# Altium schematic sheet 06-1G Phy0.SchDoc
size B; SheetNumber: 6; SheetTotal: 25; SPICEModelCacheVZIIJVTD: <root> / <DocumentId>VZIIJVTD</DocumentId> / <CacheFrame Number="0"> / <Model Name="emk105bj105_v-f" Kind="CKT"> / <Text>* EMK105BJ105_V-F     SPICE MODEL  ( General Type ) / *-------------------------------------------------------------------------------------------------------- / * Model Generated by TAIYO YUDEN Corporation (http://www.ty-top.com) / * Version 1.0 / * TAIYO YUDEN Control No. 170508_130520 / * Copyright(c) 2012 TAIYO YUDEN CO.,LTD. All Rights Reserved. / *-------------------------------------------------------------------------------------------------------- / * / * Products Name : Multilayer Ceramic Capacitors / * / * Characteristics : / *     Capacitance : 1 uF , Rated Voltage : 16V , TCC : X5R / *     Case Size : 1.0 x 0.5 / 0.039 x 0.02 [mm/inch] , Thickness : 0.5 / 0.02 [mm/inch] / *     (Conditions: Temperature = 25 degC , DC Bias Current/Voltage = 0A / 0V) / * / * Frequency Range : 40Hz - 3GHz / * / * External Node Assignments : / * / *  1  o---| |---o  2 / * / *-------------------------------------------------------------------------------------------------------- / .SubCkt EMK105BJ105_V-F 1 2 / **************************** / C0 1 110 0.68309u / Cm 1 101 0.26053u / C1 101 102 0.94076u / Rc1 101 102 1.9029k / C2 102 103 0.66707u / Rc2 102 103 120.36 / C3 103 110 0.57203u / Rc3 103 110 2.1097 / C2m 1 301 0.1871u / C21 301 302 3.2494u / Rc21 301 302 1.1117k / C22 302 303 2.1014u / Rc22 302 303 1.484k / C23 303 304 2.1172u / Rc23 303 304 1.3876k / C24 304 305 0.75729u / Rc24 304 305 332.59 / C25 305 306 0.94401u / Rc25 305 306 249.09 / C26 306 307 0.34674u / Rc26 306 307 28.352 / C27 307 308 0.37158u / Rc27 307 308 19.989 / C28 308 309 0.17933u / Rc28 308 309 31.748 / C29 309 110 0.016445u / Rc29 309 110 1.0592 / Rp0 1 110 100Meg / L0 110 120 0.2216n / Lm 120 130 0.1509n / L1 120 121 0.12659n / RL1 121 130 0.85161 / L2 120 122 0.15996n / RL2 122 130 0.42469 / L3 120 123 7.9543n / RL3 123 130 0.54643m / CR 120 124 0.24334u / LR 124 125 0.090738n / RR 125 130 68.076m / CL 130 140 2.7354p / LL 130 140 0.10762n / RL 130 140 50.614 / Rs 140 2 7.5416m / **************************** / .ends EMK105BJ105_V-F</Text> / </Model> / </CacheFrame> / </root>
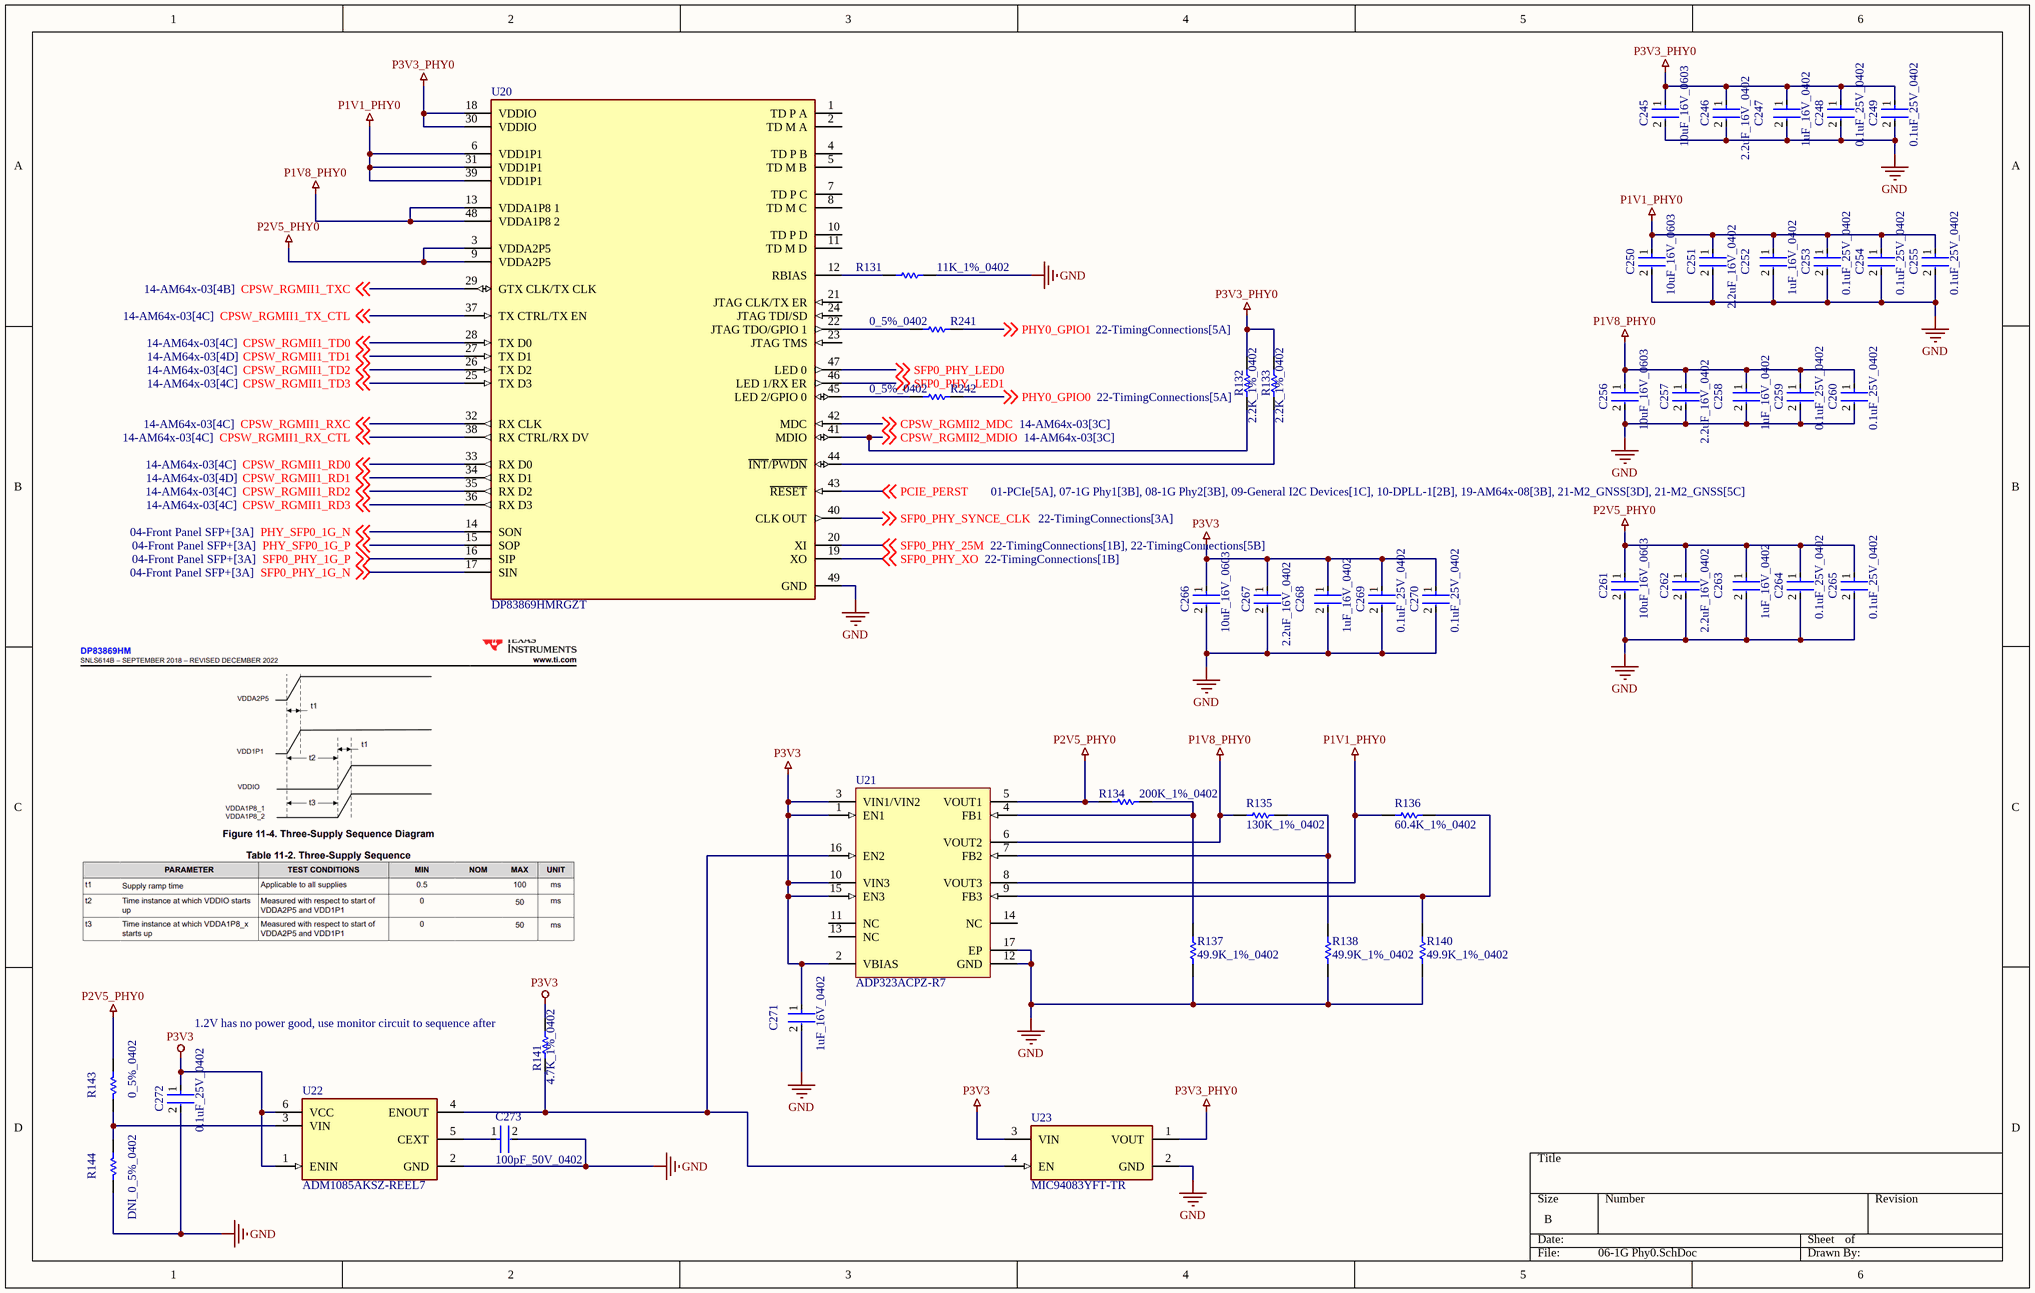
[diagram p0: 06-1G Phy0.SchDoc]

## Parts
C245  10uF_16V_0603  [FP-0603-L_1_6_0_2-W_0_8_0-MFG]
C246  2.2uF_16V_0402  [FP-C1005-050-0_05-IPC_A]
C247  1uF_16V_0402  [FP-0402-L_1_0_0_05-W_0_5-IPC_A]
C248  0.1uF_25V_0402  [FP-0402-L_1_0_1-W_0_5_0_1-IPC_C]
C249  0.1uF_25V_0402  [FP-0402-L_1_0_1-W_0_5_0_1-IPC_C]
C250  10uF_16V_0603  [FP-0603-L_1_6_0_2-W_0_8_0-MFG]
C251  2.2uF_16V_0402  [FP-C1005-050-0_05-IPC_A]
C252  1uF_16V_0402  [FP-0402-L_1_0_0_05-W_0_5-IPC_A]
C253  0.1uF_25V_0402  [FP-0402-L_1_0_1-W_0_5_0_1-IPC_C]
C254  0.1uF_25V_0402  [FP-0402-L_1_0_1-W_0_5_0_1-IPC_C]
C255  0.1uF_25V_0402  [FP-0402-L_1_0_1-W_0_5_0_1-IPC_C]
C256  10uF_16V_0603  [FP-0603-L_1_6_0_2-W_0_8_0-MFG]
C257  2.2uF_16V_0402  [FP-C1005-050-0_05-IPC_A]
C258  1uF_16V_0402  [FP-0402-L_1_0_0_05-W_0_5-IPC_A]
C259  0.1uF_25V_0402  [FP-0402-L_1_0_1-W_0_5_0_1-IPC_C]
C260  0.1uF_25V_0402  [FP-0402-L_1_0_1-W_0_5_0_1-IPC_C]
C261  10uF_16V_0603  [FP-0603-L_1_6_0_2-W_0_8_0-MFG]
C262  2.2uF_16V_0402  [FP-C1005-050-0_05-IPC_A]
C263  1uF_16V_0402  [FP-0402-L_1_0_0_05-W_0_5-IPC_A]
C264  0.1uF_25V_0402  [FP-0402-L_1_0_1-W_0_5_0_1-IPC_C]
C265  0.1uF_25V_0402  [FP-0402-L_1_0_1-W_0_5_0_1-IPC_C]
C266  10uF_16V_0603  [FP-0603-L_1_6_0_2-W_0_8_0-MFG]
C267  2.2uF_16V_0402  [FP-C1005-050-0_05-IPC_A]
C268  1uF_16V_0402  [FP-0402-L_1_0_0_05-W_0_5-IPC_A]
C269  0.1uF_25V_0402  [FP-0402-L_1_0_1-W_0_5_0_1-IPC_C]
C270  0.1uF_25V_0402  [FP-0402-L_1_0_1-W_0_5_0_1-IPC_C]
C271  1uF_16V_0402  [FP-0402-L_1_0_0_05-W_0_5-IPC_A]
C272  0.1uF_25V_0402  [FP-0402-L_1_0_1-W_0_5_0_1-IPC_C]
C273  100pF_50V_0402  [FP-C0402-BB-MFG]
R131  11K_1%_0402  [RESC1005X40X25LL05T10]
R132  2.2K_1%_0402  [RESC1005X40X25ML10T10]
R133  2.2K_1%_0402  [RESC1005X40X25ML10T10]
R134  200K_1%_0402  [RESC1005X40X25LL10T10]
R135  130K_1%_0402  [RESC1005X40X25NL10T10]
R136  60.4K_1%_0402  [RESC1005X40X25LL05T10]
R137  49.9K_1%_0402  [RESC1005X40X25LL10T10]
R138  49.9K_1%_0402  [RESC1005X40X25LL10T10]
R140  49.9K_1%_0402  [RESC1005X40X25LL10T10]
R141  4.7K_1%_0402  [RESC1005X40X25NL10T10]
R143  0_5%_0402  [RESC1005X40X25LL10T10]
R144  DNI_0_5%_0402  [RESC1005X40X25LL10T10]  (no BOM)
R241  0_5%_0402  [RESC1005X40X25LL10T10]
R242  0_5%_0402  [RESC1005X40X25LL10T10]
U20  DP83869HMRGZT  [FP-RGZ0048B-IPC_A]
U21  ADP323ACPZ-R7  [ADI-CP-16-27_N]
U22  ADM1085AKSZ-REEL7  [FP-KS-6-IPC_B]
U23  MIC94083YFT-TR  [FP-FTDFN085085-4LD-PL-1-MFG]

## Nets
GND: C245.2 C246.2 C247.2 C248.2 C249.2 C250.2 C251.2 C252.2 C253.2 C254.2 C255.2 C256.2 C257.2 C258.2 C259.2 C260.2 C261.2 C262.2 C263.2 C264.2 C265.2 C266.2 C267.2 C268.2 C269.2 C270.2 C271.2 C272.2 C273.2 R131.2 R137.1 R138.1 R140.1 R144.2 U20.49(GND) U21.12(GND) U21.17(EP) U22.2(GND) U23.2(GND)
P1V1_PHY0: C250.1 C251.1 C252.1 C253.1 C254.1 C255.1 R136.1 U20.6(VDD1P1) U20.31(VDD1P1) U20.39(VDD1P1) U21.8(VOUT3)
P1V8_PHY0: C256.1 C257.1 C258.1 C259.1 C260.1 R135.1 U20.13(VDDA1P8_1) U20.48(VDDA1P8_2) U21.6(VOUT2)
P2V5_PHY0: C261.1 C262.1 C263.1 C264.1 C265.1 R134.1 R143.1 U20.3(VDDA2P5) U20.9(VDDA2P5) U21.5(VOUT1)
P3V3: C266.1 C267.1 C268.1 C269.1 C270.1 C271.1 C272.1 R141.1 U21.1(EN1) U21.2(VBIAS) U21.3(VIN1/VIN2) U21.10(VIN3) U21.15(EN3) U22.1(ENIN) U22.6(VCC) U23.3(VIN)
P3V3_PHY0: C245.1 C246.1 C247.1 C248.1 C249.1 R132.2 R133.2 U20.18(VDDIO) U20.30(VDDIO) U23.1(VOUT)
CPSW_RGMII1_RD0: U20.33(RX_D0) ; off-sheet CPSW_RGMII1_RD0
CPSW_RGMII1_RD1: U20.34(RX_D1) ; off-sheet CPSW_RGMII1_RD1
CPSW_RGMII1_RD2: U20.35(RX_D2) ; off-sheet CPSW_RGMII1_RD2
CPSW_RGMII1_RD3: U20.36(RX_D3) ; off-sheet CPSW_RGMII1_RD3
CPSW_RGMII1_RX_CTL: U20.38(RX_CTRL/RX_DV) ; off-sheet CPSW_RGMII1_RX_CTL
CPSW_RGMII1_RXC: U20.32(RX_CLK) ; off-sheet CPSW_RGMII1_RXC
CPSW_RGMII1_TD0: U20.28(TX_D0) ; off-sheet CPSW_RGMII1_TD0
CPSW_RGMII1_TD1: U20.27(TX_D1) ; off-sheet CPSW_RGMII1_TD1
CPSW_RGMII1_TD2: U20.26(TX_D2) ; off-sheet CPSW_RGMII1_TD2
CPSW_RGMII1_TD3: U20.25(TX_D3) ; off-sheet CPSW_RGMII1_TD3
CPSW_RGMII1_TX_CTL: U20.37(TX_CTRL/TX_EN) ; off-sheet CPSW_RGMII1_TX_CTL
CPSW_RGMII1_TXC: U20.29(GTX_CLK/TX_CLK) ; off-sheet CPSW_RGMII1_TXC
CPSW_RGMII2_MDC: U20.42(MDC) ; off-sheet CPSW_RGMII2_MDC
CPSW_RGMII2_MDIO: R132.1 U20.41(MDIO) ; off-sheet CPSW_RGMII2_MDIO
PCIE_PERST: U20.43(~{RESET}) ; off-sheet PCIE_PERST
PHY0_GPIO0: R242.2 ; off-sheet PHY0_GPIO0
PHY0_GPIO1: R241.2 ; off-sheet PHY0_GPIO1
PHY_SFP0_1G_N: U20.14(SON) ; off-sheet PHY_SFP0_1G_N
PHY_SFP0_1G_P: U20.15(SOP) ; off-sheet PHY_SFP0_1G_P
SFP0_PHY_1G_N: U20.17(SIN) ; off-sheet SFP0_PHY_1G_N
SFP0_PHY_1G_P: U20.16(SIP) ; off-sheet SFP0_PHY_1G_P
SFP0_PHY_25M: U20.20(XI) ; off-sheet SFP0_PHY_25M
SFP0_PHY_LED0: U20.47(LED_0) ; off-sheet SFP0_PHY_LED0
SFP0_PHY_LED1: U20.46(LED_1/RX_ER) ; off-sheet SFP0_PHY_LED1
SFP0_PHY_SYNCE_CLK: U20.40(CLK_OUT) ; off-sheet SFP0_PHY_SYNCE_CLK
SFP0_PHY_XO: U20.19(XO) ; off-sheet SFP0_PHY_XO
NetC273_1: C273.1 U22.5(CEXT)
NetR131_1: R131.1 U20.12(RBIAS)
NetR133_1: R133.1 U20.44(~{INT}/~{PWDN})
NetR134_2: R134.2 R137.2 U21.4(FB1)
NetR135_2: R135.2 R138.2 U21.7(FB2)
NetR136_2: R136.2 R140.2 U21.9(FB3)
NetR141_2: R141.2 U21.16(EN2) U22.4(ENOUT) U23.4(EN)
NetR143_2: R143.2 R144.1 U22.3(VIN)
NetR241_1: R241.1 U20.22(JTAG_TDO/GPIO_1)
NetR242_1: R242.1 U20.45(LED_2/GPIO_0)

Not connected (* = marked no-connect by the designer): U20 1(TD_P_A) 2(TD_M_A) 4(TD_P_B) 5(TD_M_B) 7(TD_P_C) 8(TD_M_C) 10(TD_P_D) 11(TD_M_D) 21(JTAG_CLK/TX_ER) 23(JTAG_TMS) 24(JTAG_TDI/SD); U21 11(NC) 13(NC) 14(NC)

## Notes on the sheet
- (near R141) 1.2V has no power good, use monitor circuit to sequence after

## Library data of the parts
C245 C250 C256 C261 C266 = CMP-2000-06226-4: Multilayer Ceramic Capacitor 10uF 16V X5R 20% SMD 0603 T/R; Packaging: Tape and Reel; Construction: Flat; Height: 0.8mm; Max Operating Temperature: 85°C; Dielectric: X5R; Case Code (Metric): 1608; Voltage Rating (DC): 16V; Width: 0.031inch; Voltage Rating: 16V; Length: 0.063inch; RoHS Compliant: Yes; Halogen Free: Halogen Free; Case Code (Imperial): 0603; Capacitance: 10uF; Mount: Surface Mount; Thickness: 0.031inch; Tolerance: 20%; Min Operating Temperature: -55°C; Series: M; Termination: SMD/SMT; Case/Package: 0603; Package Quantity: 1
C246 C251 C257 C262 C267 = CMP-2000-05998-2: Multilayer Ceramic Capacitors 2.2μF ±10% 16V X5R SMD 0402; Capacitance: 2.2uF; REACH SVHC: No SVHC; Series: C; Termination: SMD/SMT; Case Code (Imperial): 0402; Depth: 0.5mm; Mount: Surface Mount; Width: 0.02inch; Package Quantity: 1; Dielectric Material: Ceramic; Length: 1mm; Packaging: Tape and Reel; Case Code (Metric): 1005; RoHS Compliant: Yes; Dielectric: X5R; Max Operating Temperature: 85°C; Lead Free: Lead Free; Weight: 2.3E-05oz; Thickness: 0.022inch; Voltage Rating (DC): 16V; Tolerance: 10%; Voltage Rating: 16V; Resistor Type: Ceramic; Height: 0.5mm; Case/Package: 0402; Min Operating Temperature: -55°C
C247 C252 C258 C263 C268 C271 = CMP-14477-000104-2: None; Tolerance: 10%; Voltage Rating: 16V; Dielectric: X5R; Capacitance: 1uF; Packaging: Tape and Reel; Depth: 0.5mm; Mount: Surface Mount; Thickness: 0.022inch; Package Quantity: 1; Min Operating Temperature: -55°C; Series: M; Voltage Rating (DC): 16V; Termination: SMD/SMT; Case/Package: 0402; Number of Pins: 2; Case Code (Imperial): 0402; Length: 1mm; Halogen Free: Halogen Free; Case Code (Metric): 1005; Width: 0.02inch; RoHS Compliant: Yes; Radiation Hardening: No; Max Operating Temperature: 85°C; Height: 0.5mm; Construction: Flat
C248 C249 C253-C255 C259 C260 C264 C265 C269 C270 C272 = CMP-2008-02519-2: General Purpose Ceramic Capacitor, 0402, 100nF, 10%, X7R, 15%, 25V; Package Quantity: 1; Capacitance: 100nF; Min Operating Temperature: -55°C; Voltage: 25V; Voltage Rating: 25V; Construction: Flat; Max Operating Temperature: 125°C; Radiation Hardening: No; Depth: 0.5mm; Thickness: 0.022inch; Voltage Rating (DC): 25V; Number of Pins: 2; Lead Free: Lead Free; Series: -; REACH SVHC: No SVHC; Length: 1mm; Dielectric: X7R; RoHS Compliant: Yes; Mount: Surface Mount; Packaging: Tape and Reel; Case/Package: 0402; Case Code (Imperial): 0402; Termination: SMD/SMT; Width: 0.02inch; Case Code (Metric): 1005; Tolerance: 10%
C273 = CMP-2008-03417-2: CAP CER 100PF 50V C0G/NP0 0402; Manufacturer: Kemet; Manufacturer Part Number: C0402C101G5GACTU; Material: Ceramic; Temperature Characteristic: C0G; Tolerance: 0.02; Temperature Coefficient: 15%; Temperature Range High: +125°C; Lead Free: Yes; Capacitance: 100 pF; Value: 100 pF; ComponentLink2URL: https://content.kemet.com/datasheets/KEM_C1002_X7R_SMD.pdf; Automotive: No; Voltage Rating: 50 V; Category: Cap; Device Class L2: Capacitors; ComponentLink2Description: Datasheet; Mouser Description: Multilayer Ceramic Capacitors MLCC - SMD/SMT 50volts 100pF C0G 2%; RoHS: TRUE; Device Class L3: Ceramic Capacitors; Temperature Range Low: -55°C; Octopart: https://octopart.com/c0402c101g5gactu-kemet-16782744; Height: 0.55mm; Ipc Land Pattern Name: CAPC10050X50; Package: C0402-BB; Device Class L1: Passive Components; Temperature: -55°C to +125°C; Digikey Description: CAP CER 100PF 50V C0G/NP0 0402
R131 = CMP-2002-07365-1: Manufacturer: Yageo / Phycomp; Part Number: RC0402FR-0711KL
R132 R133 = CMP-2002-06097-1: Part Number: MC00625W040212K2; Manufacturer: Multicomp
R134 = CMP-2002-04904-1: Part Number: CR0402-FX-2003GLF; Manufacturer: Bourns
R135 = CMP-2002-05688-1: Part Number: CRG0402F130K; Manufacturer: TE Connectivity / AMP
R136 = CMP-2002-07763-1: Manufacturer: Yageo / Phycomp; Part Number: RC0402FR-0760K4L
R137 R138 R140 = CMP-1011-00702-2: Manufacturer: Bourns; Part Number: CR0402-FX-4992GLF
R141 = CMP-2002-05217-1: Manufacturer: Bourns; Part Number: CR0402-FX-4701GLF
R143 R144 R241 R242 = CMP-2002-04569-1: Manufacturer: KOA Speer; Part Number: RK73Z1ETTP
U20 = CMP-04874-000002-2: IC TRANSCEIVER 1/1 48FN; RoHS Compliant: Yes
U21 = CMP-0786-00062-1: Triple, 200 mA, Low Noise, High PSRR Voltage Regulator, 2.5 to 5.5 V Vin, Adjustable Vout, Industrial, 16-pin QFN (CP-16-27), Reel; Manufacturer: Analog Devices; Vout Adjustable Range: 0.5V to 5V; Iout max: 200mA; Vin (max) (V): 5.5; Supply Current IGND @ Small Load: 85uA; Vin (min) (V): 2.5; ComponentLink2URL: http://www.analog.com/static/imported-files/data_sheets/ADP322_323.pdf; Code_JEDEC: MO-229; Mounting Technology: Surface Mount; DatasheetVersion: Rev. A; PartNumber: ADP323ACPZ-R7; ComponentLink3URL: http://www.analog.com/static/imported-files/packages/PKG_PDF/LFCSP(CP)/CP_16_27.pdf; ComponentLink4Description: URL Link1; PackageVersion: 091609-A, 09/2009; ComponentLink1Description: Manufacturer URL; ComponentLink3Description: Package Specification; Packing: Reel; PackageReference: CP-16-27; ComponentLink4URL: Product URL:http://www.analog.com/en/ADP323/productSearch.html; ComponentLink1URL: http://www.analog.com/en/index.html; PackageDescription: 16-Pin Lead Frame Chip Scale Package, Body 3 x 3 mm, Pitch 0.5 mm; ComponentLink2Description: Datasheet
U22 = CMP-09140-000008-1: IC SUPERVISOR 1 CHANNEL SC70-6; Min Reset Threshold Voltage: 560mV; Operating Supply Voltage: 125V; Operating Supply Current: 10uA; Reset: Active High; Max Reset Threshold Voltage: 640mV; Watchdog Timer: No; Min Supply Voltage: 2.25V; Number of Voltages Monitored: 1; Max Supply Current: 15uA; Threshold Voltage: 600mV; Max Supply Voltage: 3.6V; Nominal Supply Current: 10uA; Mount: Surface Mount; Width: 1.35mm; Max Operating Temperature: 125°C; Lead Free: Contains Lead; Package Quantity: 3000; Undervoltage Threshold: 560mV; Type: Sequencer; Packaging: Tape and Reel; Min Operating Temperature: -40°C; Radiation Hardening: No; REACH SVHC: No SVHC; Overvoltage Threshold: 640mV; Number of Pins: 6; Case/Package: SC; Length: 2.2mm; Height: 1mm; Number of Monitored Inputs: 1
U23 = CMP-06317-000053-1: IC PWR SWITCH P-CHAN 1:1 4TMLF; Turn-On Delay Time: 1.5us; Turn-Off Delay Time: 200ns; On-State Resistance: 67mR; Output Current: 2A; Min Supply Voltage: 1.7V; Number of Outputs: 1; Interface: On/Off; Output Configuration: High Side; Max Supply Voltage: 5.5V; Radiation Hardening: No; Min Operating Temperature: -40°C; Mount: Surface Mount; Series: -; RoHS Compliant: Yes; Number of Pins: 4; Reach SVHC Compliant: Yes; On-state Resistance-Max: 67MR; Package Quantity: 5000; Packaging: Tape and Reel; Max Output Current: 2A; Supply Current: 2A; Lead Free: Lead Free; Current Rating: 2A; Max Operating Temperature: 125°C; Rated Current-Max: 2A; Nominal Supply Current: 2A